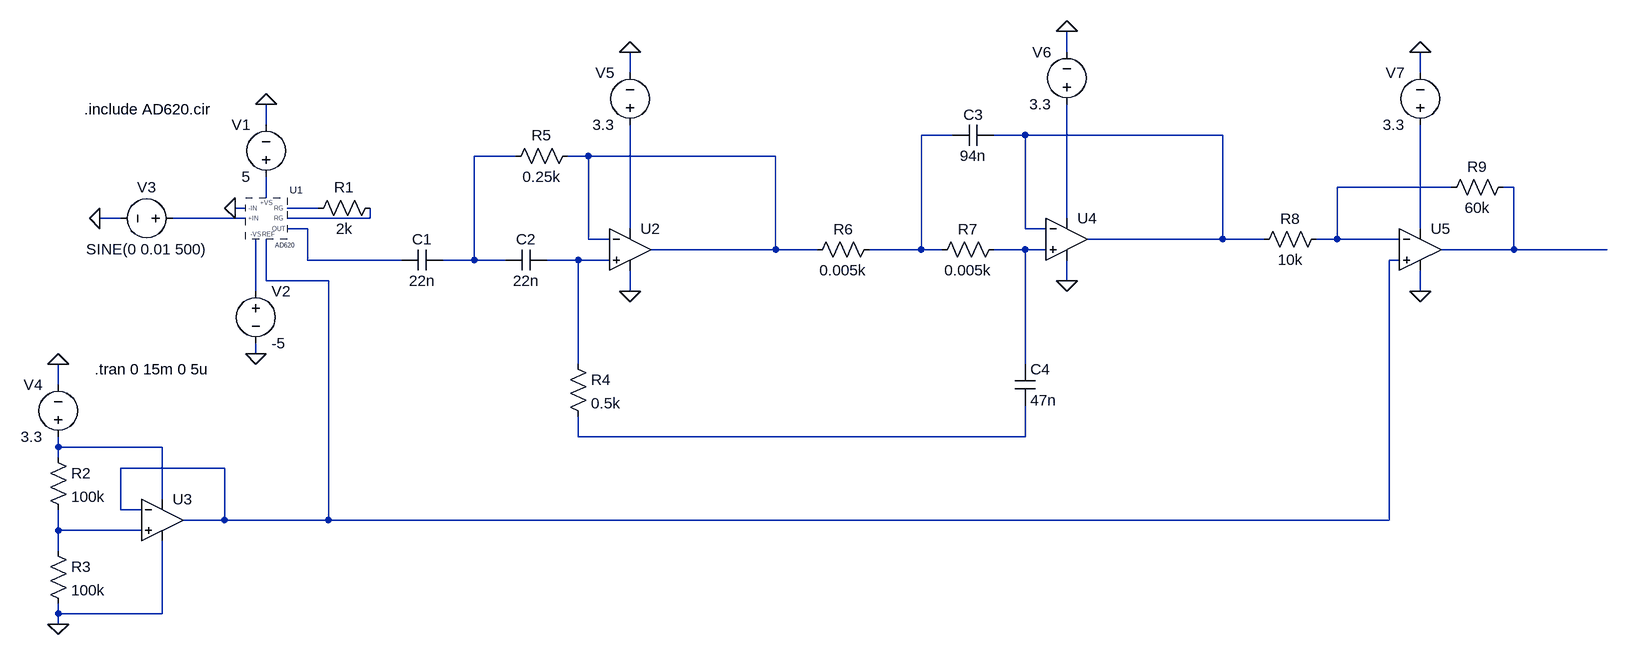
[diagram p0: schematic circuitWithSallenKey copy.asc]
circuitWithSallenKey copy.asc, the LTspice schematic file:
Version 4.1
SHEET 1 2228 920
WIRE 1392 -96 1392 -128
WIRE 720 -64 720 -96
WIRE 1936 -64 1936 -96
WIRE 160 16 160 -16
WIRE 1216 32 1168 32
WIRE 1328 32 1280 32
WIRE 1632 32 1328 32
WIRE 544 64 480 64
WIRE 656 64 624 64
WIRE 944 64 656 64
WIRE 1984 112 1808 112
WIRE 2080 112 2064 112
WIRE 160 128 160 96
WIRE 128 144 112 144
WIRE 240 144 192 144
WIRE -64 160 -96 160
WIRE 128 160 16 160
WIRE 320 160 320 144
WIRE 320 160 192 160
WIRE 1392 160 1392 -16
WIRE 224 176 192 176
WIRE 720 176 720 16
WIRE 1328 176 1328 32
WIRE 1360 176 1328 176
WIRE 1936 176 1936 16
WIRE 656 192 656 64
WIRE 688 192 656 192
WIRE 1632 192 1632 32
WIRE 1632 192 1424 192
WIRE 1696 192 1632 192
WIRE 1808 192 1808 112
WIRE 1808 192 1776 192
WIRE 1904 192 1808 192
WIRE 944 208 944 64
WIRE 944 208 752 208
WIRE 1008 208 944 208
WIRE 1168 208 1168 32
WIRE 1168 208 1088 208
WIRE 1200 208 1168 208
WIRE 1328 208 1280 208
WIRE 1360 208 1328 208
WIRE 2080 208 2080 112
WIRE 2080 208 1968 208
WIRE 2224 208 2080 208
WIRE 224 224 224 176
WIRE 368 224 224 224
WIRE 480 224 480 64
WIRE 480 224 432 224
WIRE 528 224 480 224
WIRE 640 224 592 224
WIRE 688 224 640 224
WIRE 1904 224 1888 224
WIRE 160 256 160 192
WIRE 256 256 160 256
WIRE 1392 256 1392 224
WIRE 144 272 144 192
WIRE 720 272 720 240
WIRE 1936 272 1936 240
WIRE 144 368 144 352
WIRE 640 384 640 224
WIRE 1328 384 1328 208
WIRE -160 416 -160 384
WIRE 640 496 640 464
WIRE 1328 496 1328 448
WIRE 1328 496 640 496
WIRE -160 512 -160 496
WIRE 0 512 -160 512
WIRE -160 528 -160 512
WIRE 96 544 -64 544
WIRE 0 592 0 512
WIRE -64 608 -64 544
WIRE -32 608 -64 608
WIRE 96 624 96 544
WIRE 96 624 32 624
WIRE 256 624 256 256
WIRE 256 624 96 624
WIRE 1888 624 1888 224
WIRE 1888 624 256 624
WIRE -160 640 -160 608
WIRE -32 640 -160 640
WIRE -160 672 -160 640
WIRE -160 768 -160 752
WIRE 0 768 0 656
WIRE 0 768 -160 768
WIRE -160 784 -160 768
FLAG 144 368 0
FLAG 160 -16 0
FLAG -96 160 0
FLAG 112 144 0
FLAG -160 384 0
FLAG -160 784 0
FLAG 720 272 0
FLAG 720 -96 0
FLAG 1392 256 0
FLAG 1392 -128 0
FLAG 1936 -96 0
FLAG 1936 272 0
SYMBOL res 336 128 R90
WINDOW 0 0 56 VBottom 2
WINDOW 3 32 56 VTop 2
SYMATTR InstName R1
SYMATTR Value 2k
SYMBOL Voltage 160 112 R180
WINDOW 0 24 96 Left 2
WINDOW 3 24 16 Left 2
SYMATTR InstName V1
SYMATTR Value 5
SYMBOL Voltage 144 256 R0
SYMATTR InstName V2
SYMATTR Value -5
SYMBOL Voltage 32 160 R90
WINDOW 0 -32 56 VBottom 2
WINDOW 3 32 56 VTop 2
SYMATTR InstName V3
SYMATTR Value SINE(0 0.01 500)
SYMBOL AD620 160 160 R0
WINDOW 3 14 41 Left 0
SYMATTR InstName U1
SYMBOL Res -176 512 R0
SYMATTR InstName R2
SYMATTR Value 100k
SYMBOL Res -176 656 R0
SYMATTR InstName R3
SYMATTR Value 100k
SYMBOL voltage -160 512 R180
WINDOW 0 24 96 Left 2
WINDOW 3 24 16 Left 2
SYMATTR InstName V4
SYMATTR Value 3.3
SYMBOL UniversalOpAmp 0 624 R0
SYMATTR InstName U3
SYMBOL Cap 432 208 R90
WINDOW 0 0 32 VBottom 2
WINDOW 3 32 32 VTop 2
SYMATTR InstName C1
SYMATTR Value 22n
SYMBOL Cap 592 208 R90
WINDOW 0 0 32 VBottom 2
WINDOW 3 32 32 VTop 2
SYMATTR InstName C2
SYMATTR Value 22n
SYMBOL UniversalOpAmp 720 208 R0
SYMATTR InstName U2
SYMBOL Res 624 368 R0
SYMATTR InstName R4
SYMATTR Value 0.5k
SYMBOL Voltage 720 32 R180
WINDOW 0 24 96 Left 2
WINDOW 3 24 16 Left 2
SYMATTR InstName V5
SYMATTR Value 3.3
SYMBOL Res 1104 192 R90
WINDOW 0 0 56 VBottom 2
WINDOW 3 32 56 VTop 2
SYMATTR InstName R6
SYMATTR Value 0.005k
SYMBOL Res 1296 192 R90
WINDOW 0 0 56 VBottom 2
WINDOW 3 32 56 VTop 2
SYMATTR InstName R7
SYMATTR Value 0.005k
SYMBOL UniversalOpAmp 1392 192 R0
SYMATTR InstName U4
SYMBOL Cap 1280 16 R90
WINDOW 0 0 32 VBottom 2
WINDOW 3 32 32 VTop 2
SYMATTR InstName C3
SYMATTR Value 94n
SYMBOL Cap 1312 384 R0
SYMATTR InstName C4
SYMATTR Value 47n
SYMBOL Voltage 1392 0 R180
WINDOW 0 24 96 Left 2
WINDOW 3 24 16 Left 2
SYMATTR InstName V6
SYMATTR Value 3.3
SYMBOL Res 640 48 R90
WINDOW 0 0 56 VBottom 2
WINDOW 3 32 56 VTop 2
SYMATTR InstName R5
SYMATTR Value 0.25k
SYMBOL UniversalOpAmp 1936 208 R0
SYMATTR InstName U5
SYMBOL Res 1792 176 R90
WINDOW 0 0 56 VBottom 2
WINDOW 3 32 56 VTop 2
SYMATTR InstName R8
SYMATTR Value 10k
SYMBOL Res 2080 96 R90
WINDOW 0 0 56 VBottom 2
WINDOW 3 32 56 VTop 2
SYMATTR InstName R9
SYMATTR Value 60k
SYMBOL Voltage 1936 32 R180
WINDOW 0 24 96 Left 2
WINDOW 3 24 16 Left 2
WINDOW 123 0 0 Left 0
WINDOW 39 0 0 Left 0
SYMATTR InstName V7
SYMATTR Value 3.3
TEXT -120 -8 Left 2 !.include AD620.cir
TEXT -104 392 Left 2 !.tran 0 15m 0 5u

The netlist it stands for:
* circuitWithSallenKey copy.asc
R1 N010 N008 2k
V1 N007 0 5
V2 N018 0 -5
V3 N009 0 SINE(0 0.01 500)
X§U1 N009 0 N007 N018 N012 N017 N010 N008 AD620  ; pins +IN -IN +VS -VS OUT REF RG1 RG
R2 N020 N021 100k
R3 N021 0 100k
V4 N020 0 3.3
X§U3 N021 N017 N020 0 N017 level1 Avol=1Meg GBW=10Meg Vos=0 En=0 Enk=0 In=0 Ink=0 Rin=500Meg  ; pins In+ In- V+ V- OUT
C1 N003 N012 22n
C2 N016 N003 22n
X§U2 N016 N004 N013 0 N004 level1 Avol=1Meg GBW=10Meg Vos=0 En=0 Enk=0 In=0 Ink=0 Rin=500Meg  ; pins In+ In- V+ V- OUT
R4 N016 N019 0.5k
V5 N013 0 3.3
R6 N001 N004 0.005k
R7 N015 N001 0.005k
X§U4 N015 N002 N011 0 N002 level1 Avol=1Meg GBW=10Meg Vos=0 En=0 Enk=0 In=0 Ink=0 Rin=500Meg  ; pins In+ In- V+ V- OUT
C3 N002 N001 94n
C4 N015 N019 47n
V6 N011 0 3.3
R5 N004 N003 0.25k
X§U5 N017 N005 N014 0 N006 level1 Avol=1Meg GBW=10Meg Vos=0 En=0 Enk=0 In=0 Ink=0 Rin=500Meg  ; pins In+ In- V+ V- OUT
R8 N005 N002 10k
R9 N006 N005 60k
V7 N014 0 3.3
.include AD620.cir
.tran 0 15m 0 5u
.lib UniversalOpAmp1.lib
.backanno
.end